# Altium schematic sheet Amplifier.SchDoc
size A2
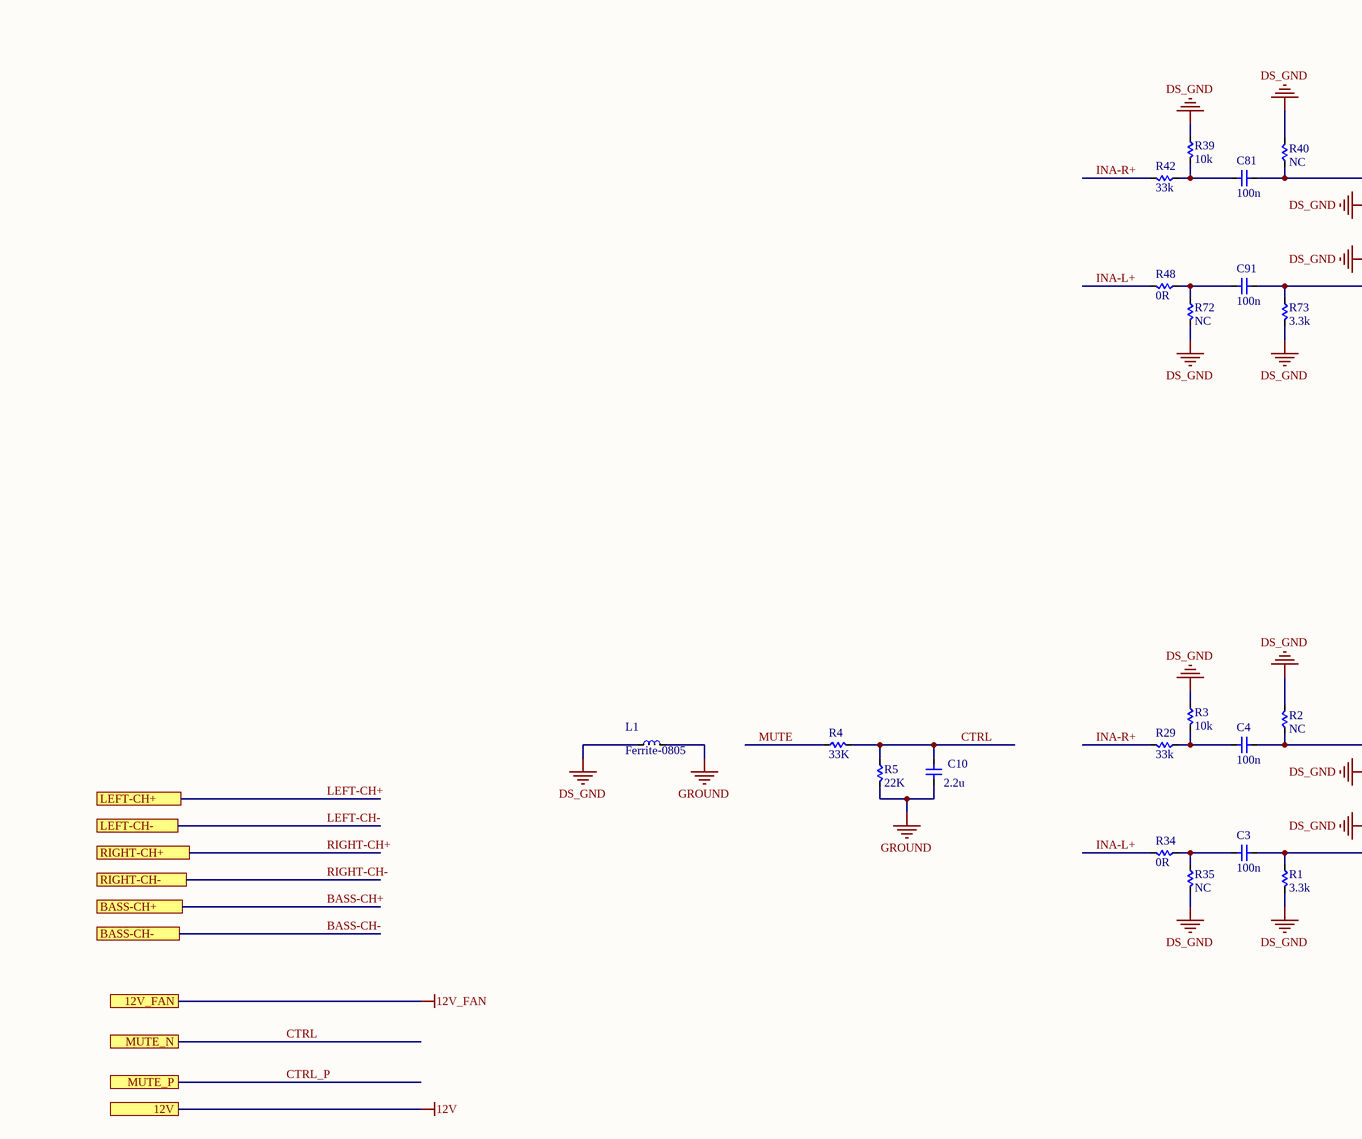
[diagram p0: Amplifier.SchDoc, top left]
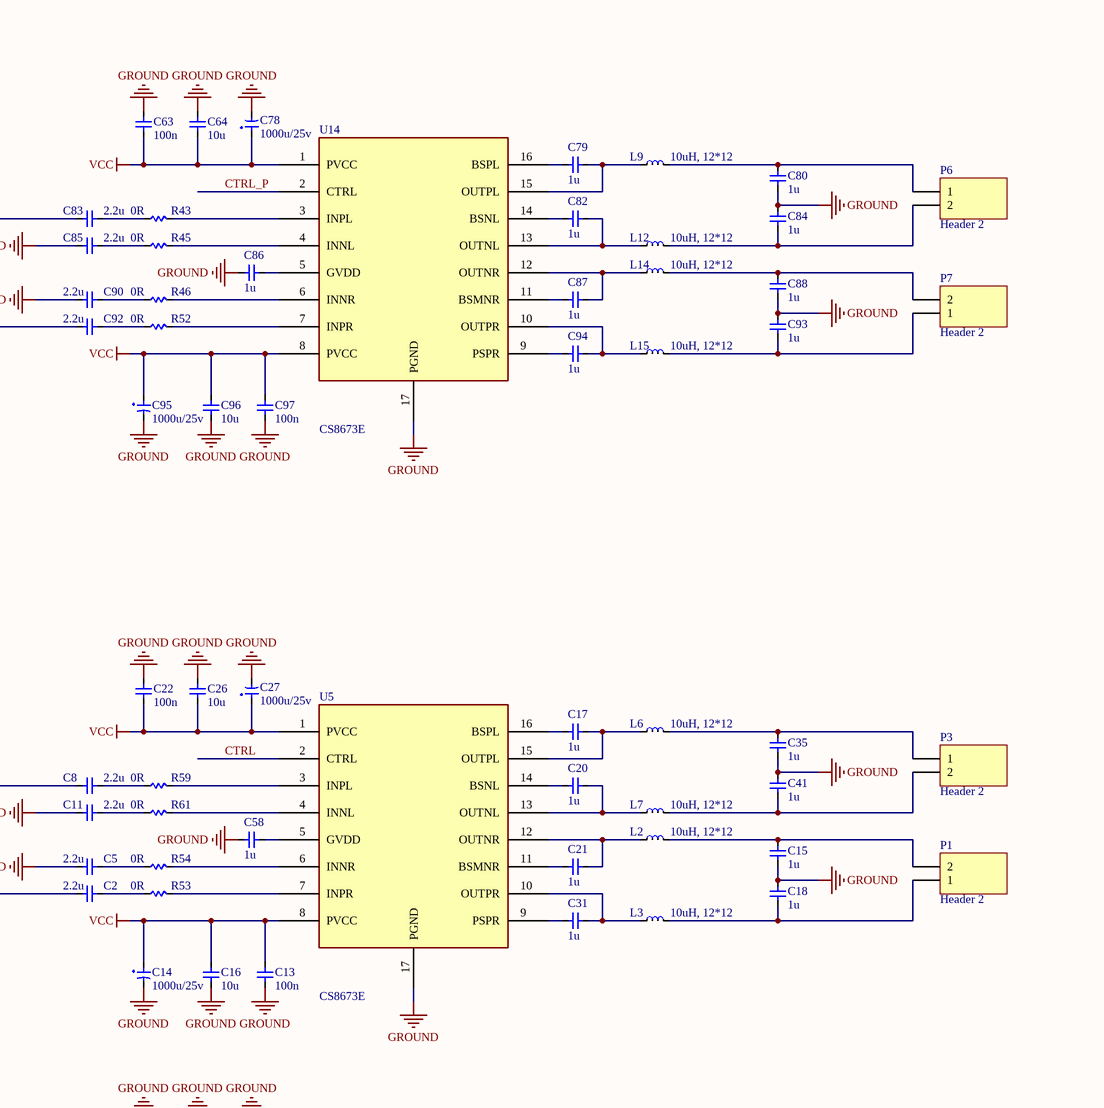
[diagram p1: Amplifier.SchDoc, top right]
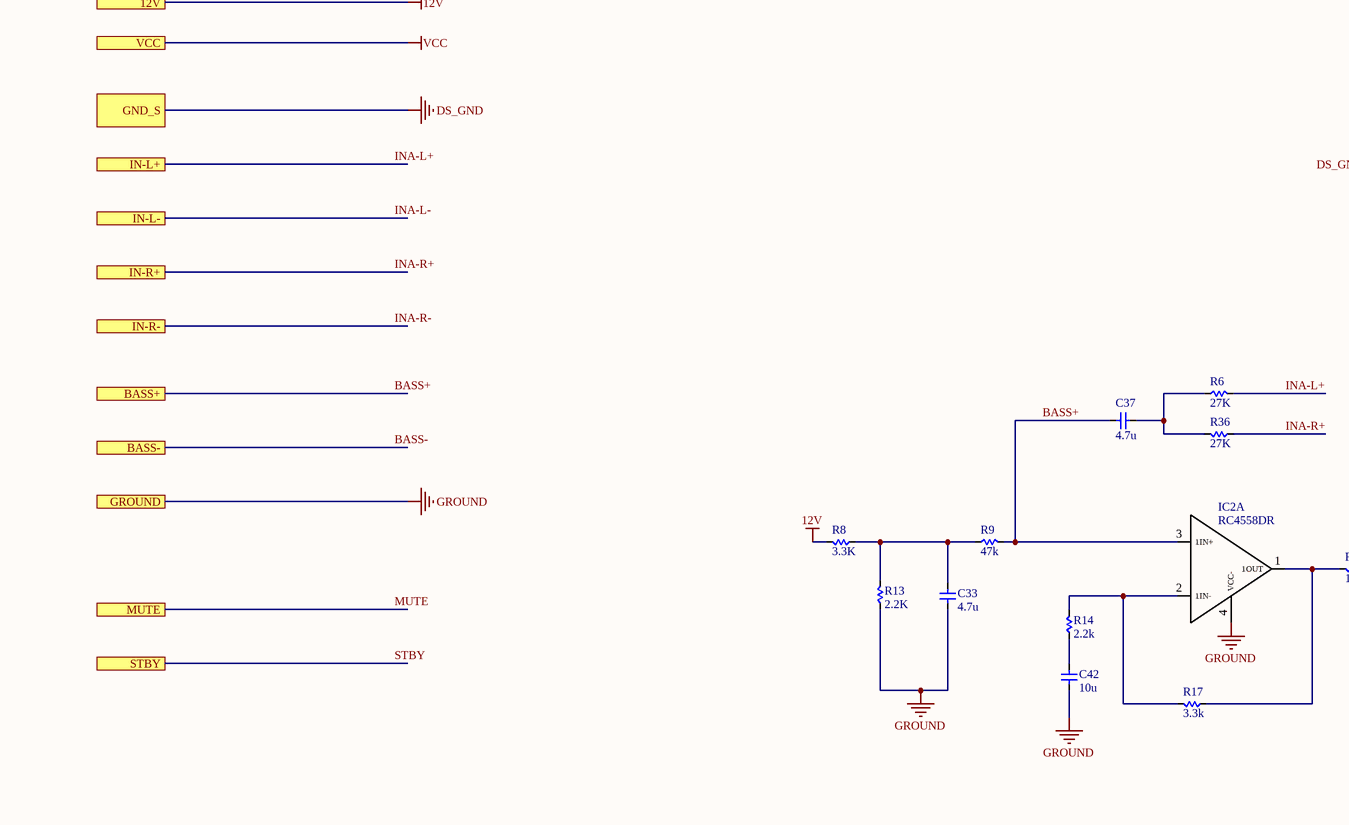
[diagram p2: Amplifier.SchDoc, bottom left]
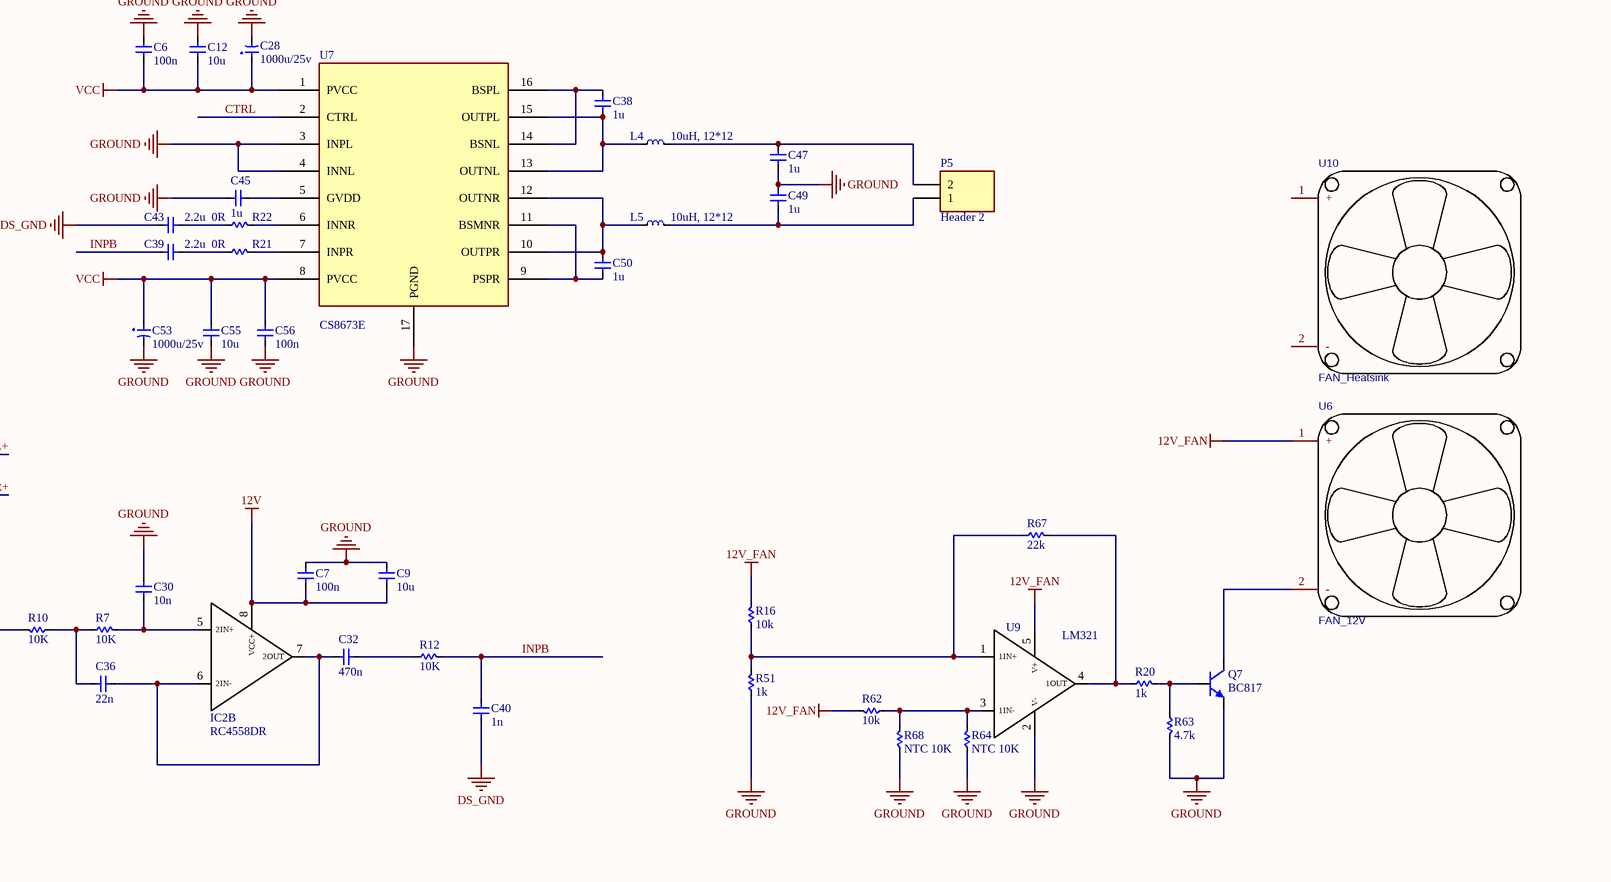
[diagram p3: Amplifier.SchDoc, bottom right]

## Parts
C2  2.2u  [cap0603]
C3  100n  [cap0603]
C4  100n  [cap0603]
C5  2.2u  [cap0603]
C6  100n  [cap0603]
C7  100n  [cap0603]
C8  2.2u  [cap0603]
C9  10u  [cap0603]
C10  2.2u  [cap0603]
C11  2.2u  [cap0603]
C12  10u  [CAP 0805]
C13  100n  [cap0603]
C14  1000u/25v  [CAP DIP 10*13]
C15  1u  [CAP 0805]
C16  10u  [CAP 0805]
C17  1u  [CAP 0805]
C18  1u  [CAP 0805]
C20  1u  [CAP 0805]
C21  1u  [CAP 0805]
C22  100n  [cap0603]
C26  10u  [CAP 0805]
C27  1000u/25v  [CAP DIP 10*13]
C28  1000u/25v  [CAP DIP 10*13]
C30  10n  [cap0603]
C31  1u  [CAP 0805]
C32  470n  [cap0603]
C33  4.7u  [cap0603]
C35  1u  [CAP 0805]
C36  22n  [cap0603]
C37  4.7u  [cap0603]
C38  1u  [CAP 0805]
C39  2.2u  [cap0603]
C40  1n  [cap0603]
C41  1u  [CAP 0805]
C42  10u  [CAP 1206]
C43  2.2u  [cap0603]
C45  1u  [cap0603]
C47  1u  [CAP 0805]
C49  1u  [CAP 0805]
C50  1u  [CAP 0805]
C53  1000u/25v  [CAP DIP 10*13]
C55  10u  [CAP 0805]
C56  100n  [cap0603]
C58  1u  [cap0603]
C63  100n  [cap0603]
C64  10u  [CAP 0805]
C78  1000u/25v  [CAP DIP 10*13]
C79  1u  [CAP 0805]
C80  1u  [CAP 0805]
C81  100n  [cap0603]
C82  1u  [CAP 0805]
C83  2.2u  [cap0603]
C84  1u  [CAP 0805]
C85  2.2u  [cap0603]
C86  1u  [cap0603]
C87  1u  [CAP 0805]
C88  1u  [CAP 0805]
C90  2.2u  [cap0603]
C91  100n  [cap0603]
C92  2.2u  [cap0603]
C93  1u  [CAP 0805]
C94  1u  [CAP 0805]
C95  1000u/25v  [CAP DIP 10*13]
C96  10u  [CAP 0805]
C97  100n  [cap0603]
IC2  RC4558DR  [RC4558]  (parts A,B of 2)
L1  Ferrite-0805  [Ferrite-0805]
L2  10uH, 12*12  [inductor 12*12]
L3  10uH, 12*12  [inductor 12*12]
L4  10uH, 12*12  [inductor 12*12]
L5  10uH, 12*12  [inductor 12*12]
L6  10uH, 12*12  [inductor 12*12]
L7  10uH, 12*12  [inductor 12*12]
L9  10uH, 12*12  [inductor 12*12]
L12  10uH, 12*12  [inductor 12*12]
L14  10uH, 12*12  [inductor 12*12]
L15  10uH, 12*12  [inductor 12*12]
P1  Header 2  [CONN-PHOENIX-5.08]
P3  Header 2  [CONN-PHOENIX-5.08]
P5  Header 2  [CONN-PHOENIX-3.81]
P6  Header 2  [CONN-PHOENIX-5.08]
P7  Header 2  [CONN-PHOENIX-5.08]
Q7  BC817  [BC817]
R1  3.3k  [RES-0603]
R2  NC  [RES-0603]
R3  10k  [RES-0603]
R4  33K  [RES-0603]
R5  22K  [RES-0603]
R6  27K  [RES-0603]
R7  10K  [RES-0603]
R8  3.3K  [RES-0603]
R9  47k  [RES-0603]
R10  10K  [RES-0603]
R12  10K  [RES-0603]
R13  2.2K  [RES-0603]
R14  2.2k  [RES-0603]
R16  10k  [RES-0603]
R17  3.3k  [RES-0603]
R20  1k  [RES-0603]
R21  0R  [RES-0603]
R22  0R  [RES-0603]
R29  33k  [RES-0603]
R34  0R  [RES-0603]
R35  NC  [RES-0603]
R36  27K  [RES-0603]
R39  10k  [RES-0603]
R40  NC  [RES-0603]
R42  33k  [RES-0603]
R43  0R  [RES-0603]
R45  0R  [RES-0603]
R46  0R  [RES-0603]
R48  0R  [RES-0603]
R51  1k  [RES-0603]
R52  0R  [RES-0603]
R53  0R  [RES-0603]
R54  0R  [RES-0603]
R59  0R  [RES-0603]
R61  0R  [RES-0603]
R62  10k  [RES-0603]
R63  4.7k  [RES-0603]
R64  NTC 10K  [RES-0805]
R67  22k  [RES-0603]
R68  NTC 10K  [RES-0805]
R72  NC  [RES-0603]
R73  3.3k  [RES-0603]
U5  CS8673E  [CS8673E]
U6  FAN_12V  [FAN_Connector XH]
U7  CS8673E  [CS8673E]
U9  LM321  [LM321]
U10  FAN_Heatsink  [FAN_Heatsink]
U14  CS8673E  [CS8673E]

## Ports
12V, 12V_FAN, BASS+, BASS-, BASS-CH+, BASS-CH-, GND_S, GROUND, IN-L+, IN-L-, IN-R+, IN-R-, LEFT-CH+, LEFT-CH-, MUTE, MUTE_N, MUTE_P, RIGHT-CH+, RIGHT-CH-, STBY, VCC

## Nets
12V: C7.2 C9.1 IC2.8(VCC+) R8.2 ; port 12V
12V_FAN: R16.2 R62.2 U6.1(+) U9.5(V+) ; port 12V_FAN
DS_GND: C5.2 C11.2 C40.1 C43.2 C85.2 C90.2 L1.2 R1.2 R2.2 R3.1 R35.2 R39.1 R40.2 R72.2 R73.2 ; port GND_S
GROUND: C6.2 C7.1 C9.2 C10.1 C12.1 C13.2 C14.2(NEG) C15.1 C16.1 C18.2 C22.2 C26.1 C27.2(NEG) C28.2(NEG) C30.1 C33.1 C35.1 C41.2 C42.1 C45.1 C47.1 C49.2 C53.2(NEG) C55.1 C56.2 C58.1 C63.2 C64.1 C78.2(NEG) C80.1 C84.2 C86.1 C88.1 C93.2 C95.2(NEG) C96.1 C97.2 IC2.4(VCC-) L1.1 Q7.2(E) R5.2 R13.1 R51.1 R63.2 R64.1 R68.1 U5.17(PGND) U7.3(INPL) U7.4(INNL) U7.17(PGND) U9.2(V-) U14.17(PGND) ; port GROUND
VCC: C6.1 C12.2 C13.1 C14.1(POS) C16.2 C22.1 C26.2 C27.1(POS) C28.1(POS) C53.1(POS) C55.2 C56.1 C63.1 C64.2 C78.1(POS) C95.1(POS) C96.2 C97.1 U5.1(PVCC) U5.8(PVCC) U7.1(PVCC) U7.8(PVCC) U14.1(PVCC) U14.8(PVCC) ; port VCC
BASS+: C37.1 IC2.3(1IN+) R9.2 ; port BASS+
BASS-: port BASS-
BASS-CH+: port BASS-CH+
BASS-CH-: port BASS-CH-
CTRL: C10.2 R4.2 R5.1 U5.2(CTRL) U7.2(CTRL) ; port MUTE_N
CTRL_P: U14.2(CTRL) ; port MUTE_P
INA-L+: R6.2 R34.2 R48.2 ; port IN-L+
INA-L-: port IN-L-
INA-R+: R29.2 R36.1 R42.2 ; port IN-R+
INA-R-: port IN-R-
INPB: C39.2 C40.2 R12.2
LEFT-CH+: port LEFT-CH+
LEFT-CH-: port LEFT-CH-
MUTE: R4.1 ; port MUTE
RIGHT-CH+: port RIGHT-CH+
RIGHT-CH-: port RIGHT-CH-
STBY: port STBY
NetC2_1: C2.1 C3.1 R1.1
NetC2_2: C2.2 R53.1
NetC3_2: C3.2 R34.1 R35.1
NetC4_1: C4.1 C8.2 R2.1
NetC4_2: C4.2 R3.2 R29.1
NetC5_1: C5.1 R54.1
NetC8_1: C8.1 R59.1
NetC11_1: C11.1 R61.1
NetC15_2: C15.2 L2.1 P1.2
NetC17_1: C17.1 L6.2 U5.15(OUTPL)
NetC17_2: C17.2 U5.16(BSPL)
NetC18_1: C18.1 L3.1 P1.1
NetC20_1: C20.1 L7.2 U5.13(OUTNL)
NetC20_2: C20.2 U5.14(BSNL)
NetC21_1: C21.1 L2.2 U5.12(OUTNR)
NetC21_2: C21.2 U5.11(BSMNR)
NetC30_2: C30.2 IC2.5(2IN+) R7.2
NetC31_1: C31.1 L3.2 U5.10(OUTPR)
NetC31_2: C31.2 U5.9(PSPR)
NetC32_1: C32.1 C36.1 IC2.6(2IN-) IC2.7(2OUT)
NetC32_2: C32.2 R12.1
NetC33_2: C33.2 R8.1 R9.1 R13.2
NetC35_2: C35.2 L6.1 P3.1
NetC36_2: C36.2 R7.1 R10.1
NetC37_2: C37.2 R6.1 R36.2
NetC38_1: C38.1 L4.2 U7.13(OUTNL) U7.15(OUTPL)
NetC38_2: C38.2 U7.14(BSNL) U7.16(BSPL)
NetC39_1: C39.1 R21.1
NetC41_1: C41.1 L7.1 P3.2
NetC42_2: C42.2 R14.1
NetC43_1: C43.1 R22.1
NetC45_2: C45.2 U7.5(GVDD)
NetC47_2: C47.2 L4.1 P5.2
NetC49_1: C49.1 L5.1 P5.1
NetC50_1: C50.1 L5.2 U7.10(OUTPR) U7.12(OUTNR)
NetC50_2: C50.2 U7.9(PSPR) U7.11(BSMNR)
NetC58_2: C58.2 U5.5(GVDD)
NetC79_1: C79.1 L9.2 U14.15(OUTPL)
NetC79_2: C79.2 U14.16(BSPL)
NetC80_2: C80.2 L9.1 P6.1
NetC81_1: C81.1 C83.2 R40.1
NetC81_2: C81.2 R39.2 R42.1
NetC82_1: C82.1 L12.2 U14.13(OUTNL)
NetC82_2: C82.2 U14.14(BSNL)
NetC83_1: C83.1 R43.1
NetC84_1: C84.1 L12.1 P6.2
NetC85_1: C85.1 R45.1
NetC86_2: C86.2 U14.5(GVDD)
NetC87_1: C87.1 L14.2 U14.12(OUTNR)
NetC87_2: C87.2 U14.11(BSMNR)
NetC88_2: C88.2 L14.1 P7.2
NetC90_1: C90.1 R46.1
NetC91_1: C91.1 C92.1 R73.1
NetC91_2: C91.2 R48.1 R72.1
NetC92_2: C92.2 R52.1
NetC93_1: C93.1 L15.1 P7.1
NetC94_1: C94.1 L15.2 U14.10(OUTPR)
NetC94_2: C94.2 U14.9(PSPR)
NetIC2_1: IC2.1(1OUT) R10.2 R17.1
NetIC2_2: IC2.2(1IN-) R14.2 R17.2
NetQ7_1: Q7.1(B) R20.2 R63.1
NetQ7_3: Q7.3(C) U6.2(-)
NetR16_1: R16.1 R51.2 R67.1 U9.1(1IN+)
NetR20_1: R20.1 R67.2 U9.4(1OUT)
NetR21_2: R21.2 U7.7(INPR)
NetR22_2: R22.2 U7.6(INNR)
NetR43_2: R43.2 U14.3(INPL)
NetR45_2: R45.2 U14.4(INNL)
NetR46_2: R46.2 U14.6(INNR)
NetR52_2: R52.2 U14.7(INPR)
NetR53_2: R53.2 U5.7(INPR)
NetR54_2: R54.2 U5.6(INNR)
NetR59_2: R59.2 U5.3(INPL)
NetR61_2: R61.2 U5.4(INNL)
NetR62_1: R62.1 R64.2 R68.2 U9.3(1IN-)

Not connected (* = marked no-connect by the designer): U10 1(+) 2(-)

## Notes on the sheet
- Title
- Size:
- Date:
- File:
- A1
- Number:
- Time:
- Revision:
- Sheet
- of

## Library data of the parts
C2 C5-C8 C11 C13 C22 C30 C32 C36 C39 C40 C43 C45 C56 C58 C63 C83 C85 C86 C90 C92 C97 = Cap 0603: Capacitor 0603; Published: 8-Jun-2000; LatestRevisionDate: 17-Jul-2002; LatestRevisionNote: Re-released for DXP Platform.; Publisher: Altium Limited; Value: *
C3 C4 C9 C10 C33 C37 C81 C91 = Cap 0603: Capacitor 0603; Value: 104; Published: 8-Jun-2000; LatestRevisionDate: 17-Jul-2002; LatestRevisionNote: Re-released for DXP Platform.; Publisher: Altium Limited
C12 C15-C18 C20 C21 C26 C31 C35 C38 C41 C47 C49 C50 C55 C64 C79 C80 C82 C84 C87 C88 C93 C94 C96 = Cap 0805: Capacitor 0805; Value: 104; Published: 8-Jun-2000; LatestRevisionDate: 17-Jul-2002; LatestRevisionNote: Re-released for DXP Platform.; Publisher: Altium Limited
C14 C27 C28 C53 C78 C95 = capacitor dip 10*13: 2200ÂµF 50V Aluminum Electrolytic Capacitors Radial, Can 1000 Hrs @ 105Â°C; MF: Nichicon; MP: UVZ1H222MHD; Package: Radial Nichicon; Value: *; Price: None; SnapEDA_Link: https://www.snapeda.com/parts/UVZ1H222MHD/Nichicon/view-part/468437/?ref=snap; Availability: Unavailable
C42 = Cap 1206: Capacitor 1206; Value: 104; Published: 8-Jun-2000; LatestRevisionDate: 17-Jul-2002; LatestRevisionNote: Re-released for DXP Platform.; Publisher: Altium Limited
IC2 = RC4558DR: Integrated Circuit SOIC 8; Manufacturer_Name: Texas Instruments; Datasheet Link: http://www.ti.com/lit/gpn/rc4558; Height: 1.75mm; Manufacturer_Part_Number: RC4558DR; Arrow Part Number: RC4558DR; Arrow Price/Stock: https://www.arrow.com/en/products/rc4558dr/texas-instruments; Mouser Part Number: 595-RC4558DR; Mouser Price/Stock: https://www.mouser.co.uk/ProductDetail/Texas-Instruments/RC4558DR?qs=DXdcjUGny5OhrzskaZRdew%3D%3D
L1 = Ferrite _0805: BLM Series 0805 330 Ohm 400 mA 0.58 Ohm DCR Surface Mount Ferrite Bead; MF: Murata; MP: BLM18BB331SN1D; Package: 0603 Murata; Price: None; Availability: Unavailable; SnapEDA_Link: https://www.snapeda.com/parts/BLM18BB331SN1D/Murata%20Electronics%20North%20America/view-part/?ref=snap; Value: *
L2-L7 L9 L12 L14 L15 = INDUCTOR 12*12: Inductor round 12*12; MP: DR127-330-R; MF: Eaton; Price: None; Package: Nonstandard Eaton; Availability: Unavailable; SnapEDA_Link: https://www.snapeda.com/parts/DR127-330-R/Eaton/view-part/?ref=snap; Value: *
P1 P3 P6 P7 = CONN-Phoenix-5.08: Phoenix Connector 5.08; LatestRevisionDate: 17-Jul-2002; LatestRevisionNote: Re-released for DXP Platform.; Publisher: Altium Limited
P5 = CONN-Phoenix-3.81_1: Phoenix Connector 3.81; LatestRevisionDate: 17-Jul-2002; LatestRevisionNote: Re-released for DXP Platform.; Publisher: Altium Limited
Q7 = BC817: NPN General Purpose Amplifier BJT; Published: 8-Jun-2000; LatestRevisionDate: 15-Jan-2003; LatestRevisionNote: PCB Footprint 'BCY-W3/D4.7' replaced; DatasheetVersion: 1997; PackageVersion: Sep-1998; PackageReference: TO-92A; Publisher: Altium Limited; PackageDescription: TO, Flat Index; 3 In-Line, Axial Leads; Body Dia. 4.5mm; Leads 0.51 x 0.48 mm (max); ComponentLink1Description: Manufacturer Link; ComponentLink1URL: http://www.fairchildsemi.com/; ComponentLink2Description: Datasheet; ComponentLink2URL: http://www.fairchildsemi.com/ds/2N%2F2N3904.pdf
R1 R4-R10 R12-R14 R16 R17 R20-R22 R36 R43 R45 R46 R51-R54 R59 R61-R63 R67 R73 = Res 0603: Resistor 0603; Published: 8-Jun-2000; LatestRevisionDate: 29-May-2009; LatestRevisionNote: IPC-7351 Footprint Added.; PackageReference: J1-0603; Publisher: Altium Limited; PackageDescription: Chip Resistor
  R1 R73: Value: 3.3k
  R4-R10 R12-R14 R17 R36: Value: *
R2 R3 R29 R34 R35 R39 R40 R42 R48 R72 = Res 0603: Resistor 0603; Value: 3.3k; Published: 8-Jun-2000; LatestRevisionDate: 29-May-2009; LatestRevisionNote: IPC-7351 Footprint Added.; PackageReference: J1-0603; Publisher: Altium Limited; PackageDescription: Chip Resistor
R64 R68 = Res 0805: resistor 0805
U5 U7 U14 = CS8673E: AB/D 2X40W BTL & 80W PBTL ESOP16; Manufacturer_Name: Chipstar; Manufacturer_Part_Number: CS8679E; Height: 2.47mm; Arrow Part Number: CS8679E; Arrow Price/Stock: https://www.arrow.com/en/products/tda7491hv13tr/stmicroelectronics; Mouser Part Number: 511-TDA7491HV13TR; Mouser Price/Stock: https://www.mouser.com/Search/Refine.aspx?Keyword=511-TDA7491HV13TR
U6 = FAN_12V: FAN 12V 40*40*10mm . XH Connector; Contributor: novasilisko; timeStamp: 1467237407; Manufacturer Part: ?; spicePre: U
U9 = LM321: Operational Amplifier 5-SOT-23; MP: OPA354AIDBVT; MF: Texas Instruments; Package: SOT-23-5 Texas Instruments; Digi-Key_Purchase_URL: https://www.digikey.de/product-detail/en/texas-instruments/OPA354AIDBVT/296-13033-1-ND/480149?utm_source=snapeda&utm_medium=aggregator&utm_campaign=symbol; SnapEDA_Link: https://www.snapeda.com/parts/OPA354AIDBVT/Texas%20Instruments/view-part/?ref=snap; Digi-Key_Part_Number: 296-13033-1-ND; Value: *
U10 = FAN_Heatsink: 55mm Aluminum Heatsink with Cooling Fan; Contributor: novasilisko; timeStamp: 1467237407; Manufacturer Part: ?; spicePre: U